# Altium project STCFocusRemotePCB.PrjPcb
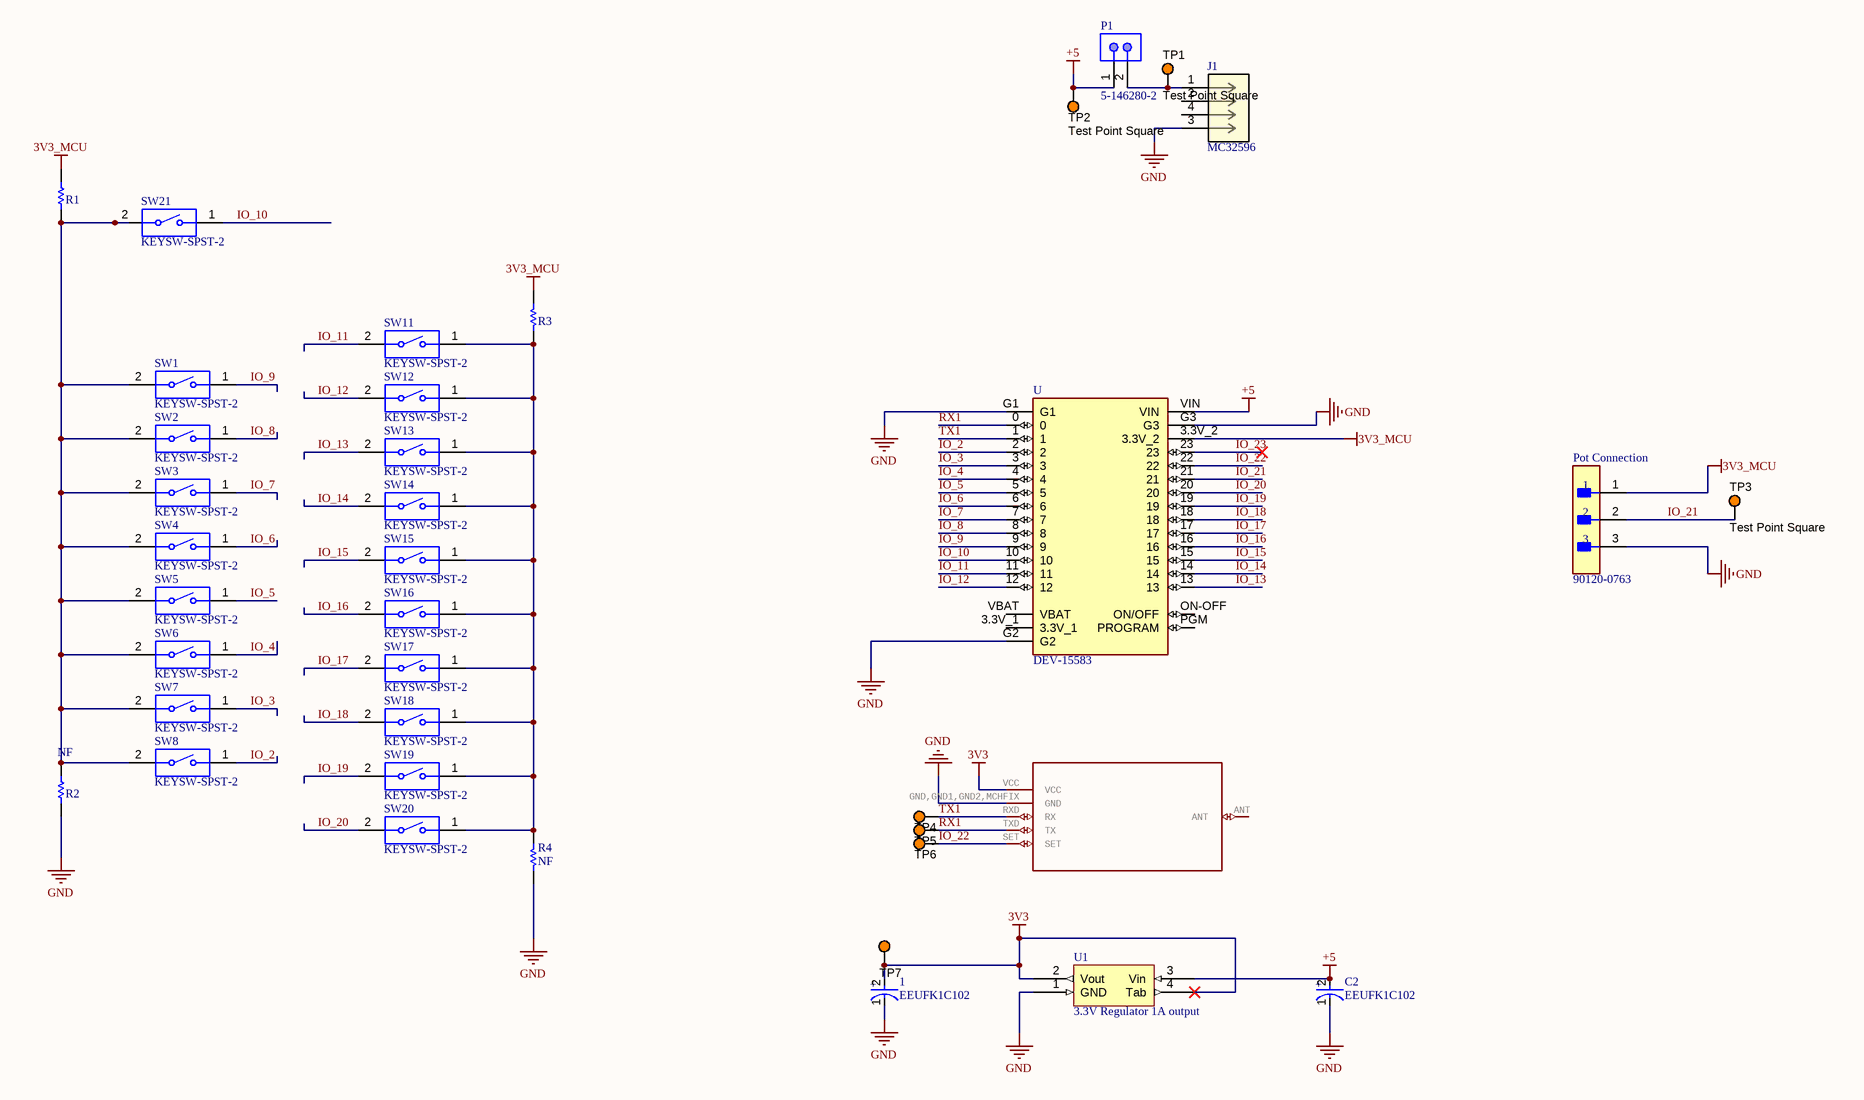
[diagram p0: Schematic.SchDoc]
1 sheet, 38 parts. Net scope: global (net labels, ports and power ports of the same name join across sheets).
Board file: PCB1.PcbDoc

## Sheet Schematic.SchDoc
size 420 x 297 mm; SheetNumber: 1; SheetTotal: 1

### Parts
1  EEUFK1C102  [FP-RAD-TH-D_10_0_5-L_16_1-MFG]
2  HC-12 433MHz module footprint   MCHFIX is for mechanical fix pin which is NC but on this file connected to GND   https://github.com/meendiz/hc-12_si4463/  [HC-12_FOOTPRINT]  (value not drawn)
C2  EEUFK1C102  [FP-RAD-TH-D_10_0_5-L_16_1-MFG]
J1  MC32596  [CONN4_MC32596_MTC]
P1  5-146280-2  [TECO-5-146280-2_V]
Pot_Connection  90120-0763  [FP-90120-0763-MFG]
R1  CRCW08050000Z0EA  [RESC2013X50X30LL20T20]  (value not drawn)
R2  NF  [RESC2013X50X30LL20T20]
R3  CRCW08050000Z0EA  [RESC2013X50X30LL20T20]  (value not drawn)
R4  NF  [RESC2013X50X30LL20T20]
SW1  KEYSW-SPST-2  [CHRY-MX1A-11NW_V]
SW2  KEYSW-SPST-2  [CHRY-MX1A-11NW_V]
SW3  KEYSW-SPST-2  [CHRY-MX1A-11NW_V]
SW4  KEYSW-SPST-2  [CHRY-MX1A-11NW_V]
SW5  KEYSW-SPST-2  [CHRY-MX1A-11NW_V]
SW6  KEYSW-SPST-2  [CHRY-MX1A-11NW_V]
SW7  KEYSW-SPST-2  [CHRY-MX1A-11NW_V]
SW8  KEYSW-SPST-2  [CHRY-MX1A-11NW_V]
SW11  KEYSW-SPST-2  [CHRY-MX1A-11NW_V]
SW12  KEYSW-SPST-2  [CHRY-MX1A-11NW_V]
SW13  KEYSW-SPST-2  [CHRY-MX1A-11NW_V]
SW14  KEYSW-SPST-2  [CHRY-MX1A-11NW_V]
SW15  KEYSW-SPST-2  [CHRY-MX1A-11NW_V]
SW16  KEYSW-SPST-2  [CHRY-MX1A-11NW_V]
SW17  KEYSW-SPST-2  [CHRY-MX1A-11NW_V]
SW18  KEYSW-SPST-2  [CHRY-MX1A-11NW_V]
SW19  KEYSW-SPST-2  [CHRY-MX1A-11NW_V]
SW20  KEYSW-SPST-2  [CHRY-MX1A-11NW_V]
SW21  KEYSW-SPST-2  [CHRY-MX1A-11NW_V]
TP1  Test Point Square  [New footprint 1]
TP2  Test Point Square  [New footprint 1]
TP3  Test Point Square  [New footprint 1]
TP4  Test Point Square  [New footprint 1]  (value not drawn)
TP5  Test Point Square  [New footprint 1]  (value not drawn)
TP6  Test Point Square  [New footprint 1]  (value not drawn)
TP7  Test Point Square  [New footprint 1]  (value not drawn)
U  DEV-15583  [MODULE_DEV-15583]
U1  3.3V Regulator 1A output  [SOT229P700X180-4N]

### Nets
3V3: 1.2(A) 2.VCC TP7.1 U1.2(Vout) U1.4(Tab)
3V3_MCU: Pot_Connection.1 R1.2 R3.2 U.3.3V_2
+5: C2.2(A) P1.1 TP2.1 U.VIN U1.3(Vin)
GND: 1.1(C) 2.GND,GND1,GND2,MCHFIX(GND) C2.1(C) J1.3 Pot_Connection.3 R2.1 R4.1 U.G1 U.G2 U.G3 U1.1(GND)
IO_2: SW8.1 U.2
IO_3: SW7.1 U.3
IO_4: SW6.1 U.4
IO_5: SW5.1 U.5
IO_6: SW4.1 U.6
IO_7: SW3.1 U.7
IO_8: SW2.1 U.8
IO_9: SW1.1 U.9
IO_10: SW21.1 U.10
IO_11: SW11.2 U.11
IO_12: SW12.2 U.12
IO_13: SW13.2 U.13
IO_14: SW14.2 U.14
IO_15: SW15.2 U.15
IO_16: SW16.2 U.16
IO_17: SW17.2 U.17
IO_18: SW18.2 U.18
IO_19: SW19.2 U.19
IO_20: SW20.2 U.20
IO_21: Pot_Connection.2 TP3.1 U.21
IO_22: 2.SET TP6.1 U.22
IO_23: U.23
RX1: 2.TXD(TX) TP5.1 U.0
TX1: 2.RXD(RX) TP4.1 U.1
NetJ1_1: J1.1 P1.2 TP1.1
NetR1_1: R1.1 R2.2 SW1.2 SW2.2 SW3.2 SW4.2 SW5.2 SW6.2 SW7.2 SW8.2 SW21.2
NetR3_1: R3.1 R4.2 SW11.1 SW12.1 SW13.1 SW14.1 SW15.1 SW16.1 SW17.1 SW18.1 SW19.1 SW20.1

Not connected (* = marked no-connect by the designer): 2 ANT; J1 2 4; U 3.3V_1 ON-OFF(ON/OFF) PGM(PROGRAM) VBAT

### Notes on the sheet
- DWG NO:
- REV:
- PROJECT
- TITLE
- FILE NAME
- A3
- SIZE
- SHEET
- OF
- REV
- (in symbol CMP-05427-001094-1) +

### Library data of the parts
1 C2 = CMP-05427-001094-1: Aluminum Electrolytic Capacitors (Radial Lead Type) AEC-Q200 Qualified 1000uF ±20% 16V; Dielectric Material: Aluminium; Capacitance: 1mF; Ripple Current: 1.24A; Life (Hours): 4000Hour; Lead Diameter: 0.6mm; Impedance: 49mR; Case/Package: Radial; Max Operating Temperature: 105°C; Diameter: 10mm; Termination: Radial; Series: FK Radial; REACH SVHC: No SVHC; Voltage: 16V; Tolerance: 20%; Min Operating Temperature: -55°C; Packaging: Bulk; Mount: Through Hole; Radiation Hardening: No; Construction: RADIAL; Height: 16mm; RoHS Compliant: Yes; Voltage Rating (DC): 16V; Lead Pitch: 5mm; Number of Pins: 2; Voltage Rating: 16V
2 = HC-12_FOOTPRINT: GateName_1: G$1; SymbolName_1: HC-12_FOOTPRINT; LibraryName: hc12_433mhz; DeviceSetName: HC-12_FOOTPRINT; Package: HC-12_FOOTPRINT
J1 = MC32596: No Description Available; Mfr_Name: Multicomp; Copyright: Copyright (C) 2023 Ultra Librarian. All rights reserved.; Manufacturer_Part_Number: MC32596; RefDes: RefDes; Type: DEV
P1 = CMP-2000-07492-1: Male Header, Pitch 2.54 mm, 1 x 2 Position, Height 8.21 mm, Tail Length 3.05 mm, -65 to 105 degC, RoHS, Bulk; Manufacturer: TE Connectivity; Mating Connector Lock: No(Without); Number of Positions: 2; Pitch: 2.54mm; PCB Mounting Orientation: Vertical; Keyed: No; Case\/Package: 100; Mating Post Length: 0.23inch; High Temperature Housing: Yes; Max Current Rating: 5A; PCB Thickness: 0.063inch; PCB Mount Retention: Without; Approvals: CSA; Current Rating: 3A; Radiation Hardening: No; Length: 4.67mm; Contact Mating Length: 0.23inch; Connector Type: Header; Number of Rows: 1; Termination Post Length: 0.12inch; Board Standoff: No(Without); Max Operating Temperature: 105degC; Contact Shape: Square; Selectively Loaded: No(Without); Gasket: No(Without); Number of Contacts: 2; Contact Gender: Male; Mating Alignment: No(Without); Manufacturer URL: http://www.te.com/; Datasheet URL: http://www.te.com/commerce/DocumentDelivery/DDEController?Action=showdoc&DocId=Customer+Drawing%7F146280%7FH1%7Fpdf%7FEnglish%7FENG_CD_146280_H1.pdf%7F5-146280-2; Mount: ThroughHole; Orientation: Straight; Packaging: Carton; Package Reference: 5-146280-2; Package Quantity: 500; Stabilizers: No(Without); Row Spacing: 2.54mm; Contact Material: CopperAlloy; Panel Mount Retention: No(Without); Datasheet Version: Rev. H1, 08/2016; Housing Colour: Black; Colour: Black; Package Description: Male Header, Pitch 2.54 mm, 1 x 2 Position, Height 8.21 mm, Tail Length 3.05 mm; Contact Plating: Matte; Housing Material: Polymer; Contact Protection: No(Without); Min Operating Temperature: -65degC; Mounting Technology: ThroughHole; Flammability Rating: UL94V-0; RoHSCompliant: true; Termination: ThroughHole; Depth: 2.34mm; High Speed Serial Data Connector: No
Pot_Connection = CMP-04776-000084-1: CONN HEADER VERT 3POS 2.54MM; Manufacturer: Molex; Voltage Rating: 350V; Number Of Contacts: 3; Conn Orientation: Vertical; Current Rating: 3A; Conn Gender: Male; Description: Board-To-Board Connector, C-Grid III 90120 Series, Through Hole, Header, 3, 2.54 mm; Package: 90120-0763; ComponentLink2Description: Datasheet; Height: 5.8mm; Manufacturer Part Number: 90120-0763; Temperature Range High: +125°C; RoHS: TRUE; ComponentLink2URL: https://www.molex.com/webdocs/datasheets/pdf/en-us/0901200763_PCB_HEADERS.pdf; Device Class L2: Headers and Wire Housings; Temperature: -55°C to +125°C; Device Class L1: Connectors; Pitch: 2.54mm; Footprint Url: https://www.molex.com/pdm_docs/sd/901200763_sd.pdf; Device Class L3: unset; Temperature Range Low: -55°C; Number Of Rows: 1; Category: Conn; Lead Free: Yes; Mouser Description: Board-To-Board Connector, C-Grid III 90120 Series, Through Hole, Header, 3, 2.54 mm; Octopart: https://octopart.com/90120-0763-molex-655433; Contact Material: Gold,Nickel; Automotive: No; Digikey Description: CONN HEADER VERT 3POS 2.54MM
R1 R3 = CMP-2001-04896-1: Manufacturer: Vishay Dale; Part Number: CRCW08050000Z0EA
R2 R4 = CMP-2001-04896-1: Manufacturer: Vishay Dale; Part Number: CRCW08050000Z0EA
TP1-TP7 = CMP-001-0001-1: 1.5mm Square testpoint
U = DEV-15583: RT1062 Teensy 4.0 i.MX ARMÂ® CortexÂ®-M7 MPU Embedded Evaluation Board; MF: SparkFun Electronics; Value: *; Package: None; Digi-Key_Part_Number: 1568-DEV-15583-ND; Digi-Key_Purchase_URL: https://www.digikey.com/product-detail/en/sparkfun-electronics/DEV-15583/1568-DEV-15583-ND/10384551?utm_source=snapeda&utm_medium=aggregator&utm_campaign=symbol; MP: DEV-15583; SnapEDA_Link: https://www.snapeda.com/parts/DEV-15583/SparkFun%20Electronics/view-part/4001229/?ref=snap
U1 = AMS1117-3.3